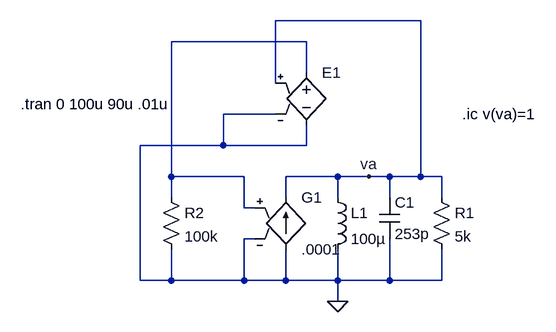
[diagram p0: schematic sintonizado_teorico.asc]
sintonizado_teorico.asc, the LTspice schematic file:
Version 4
SHEET 1 880 680
WIRE 448 -176 224 -176
WIRE 272 -144 64 -144
WIRE 272 -96 272 -144
WIRE 224 -80 224 -176
WIRE 224 -32 144 -32
WIRE 144 16 144 -32
WIRE 144 16 16 16
WIRE 272 16 272 -16
WIRE 272 16 144 16
WIRE 64 64 64 -144
WIRE 176 64 64 64
WIRE 320 64 240 64
WIRE 368 64 320 64
WIRE 400 64 368 64
WIRE 448 64 448 -176
WIRE 448 64 400 64
WIRE 480 64 448 64
WIRE 64 96 64 64
WIRE 240 96 240 64
WIRE 320 96 320 64
WIRE 400 96 400 64
WIRE 480 96 480 64
WIRE 176 112 176 64
WIRE 192 112 176 112
WIRE 192 160 176 160
WIRE 16 224 16 16
WIRE 64 224 64 176
WIRE 64 224 16 224
WIRE 176 224 176 160
WIRE 176 224 64 224
WIRE 240 224 240 176
WIRE 240 224 176 224
WIRE 320 224 320 176
WIRE 320 224 240 224
WIRE 400 224 400 160
WIRE 400 224 320 224
WIRE 480 224 480 176
WIRE 480 224 400 224
WIRE 320 256 320 224
FLAG 320 256 0
FLAG 368 64 va
SYMBOL g 240 80 R0
SYMATTR InstName G1
SYMATTR Value .0001
SYMBOL ind 304 80 R0
SYMATTR InstName L1
SYMATTR Value 100µ
SYMBOL cap 384 96 R0
SYMATTR InstName C1
SYMATTR Value 253p
SYMBOL res 464 80 R0
SYMATTR InstName R1
SYMATTR Value 5k
SYMBOL res 48 80 R0
SYMATTR InstName R2
SYMATTR Value 100k
SYMBOL e 272 -112 R0
WINDOW 3 24 96 Invisible 2
SYMATTR Value (-100,-12)(-60u,-12)(60u,12)(100,12)
SYMATTR InstName E1
SYMATTR SpiceModel table
TEXT -168 -48 Left 2 !.tran 0 100u 90u .01u
TEXT 512 -32 Left 2 !.ic v(va)=1

The netlist it stands for:
* sintonizado_teorico.asc
G1 0 va N001 0 .0001
L1 va 0 100µ
C1 va 0 253p
R1 va 0 5k
R2 N001 0 100k
E1 N001 0 va 0 table (-100,-12)(-60u,-12)(60u,12)(100,12)
.tran 0 100u 90u .01u
.ic v(va)=1
.backanno
.end